# Altium project SCREEN.PrjPCB
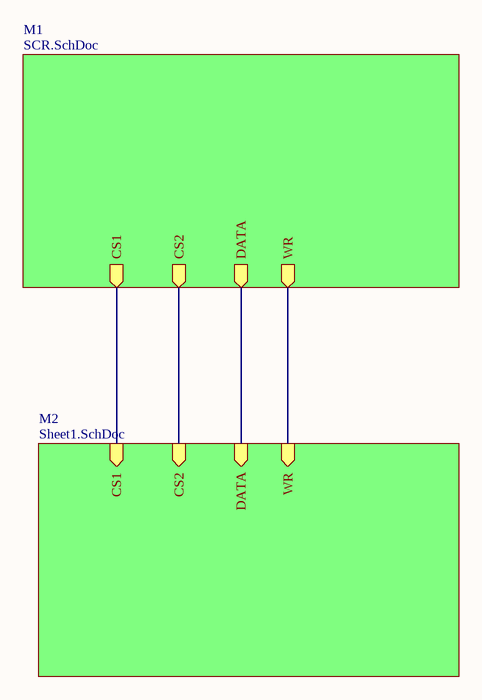
[diagram p0: Sheet4.SchDoc]
3 sheets, 109 parts. Net scope: hierarchical (ports join the sheet entries above them; power ports are global).
Board file: JD1622(V4).PcbDoc
Sheets:
  Sheet4.SchDoc
    M1 = SCR.SchDoc
    M2 = Sheet1.SchDoc

## Sheet Sheet4.SchDoc
size A4

### Sub-sheets
M1 = SCR.SchDoc: CS1 (out), CS2 (out), DATA (out), WR (out)
M2 = Sheet1.SchDoc: CS1 (in), CS2 (in), DATA (in), WR (in)

### Nets
NetR30_1: sheet M1/CS2, sheet M2/CS2
NetR32_1: sheet M1/WR, sheet M2/WR
NetR35_1: sheet M1/DATA, sheet M2/DATA
NetR37_1: sheet M1/CS1, sheet M2/CS1

## Sheet SCR.SchDoc
size A2
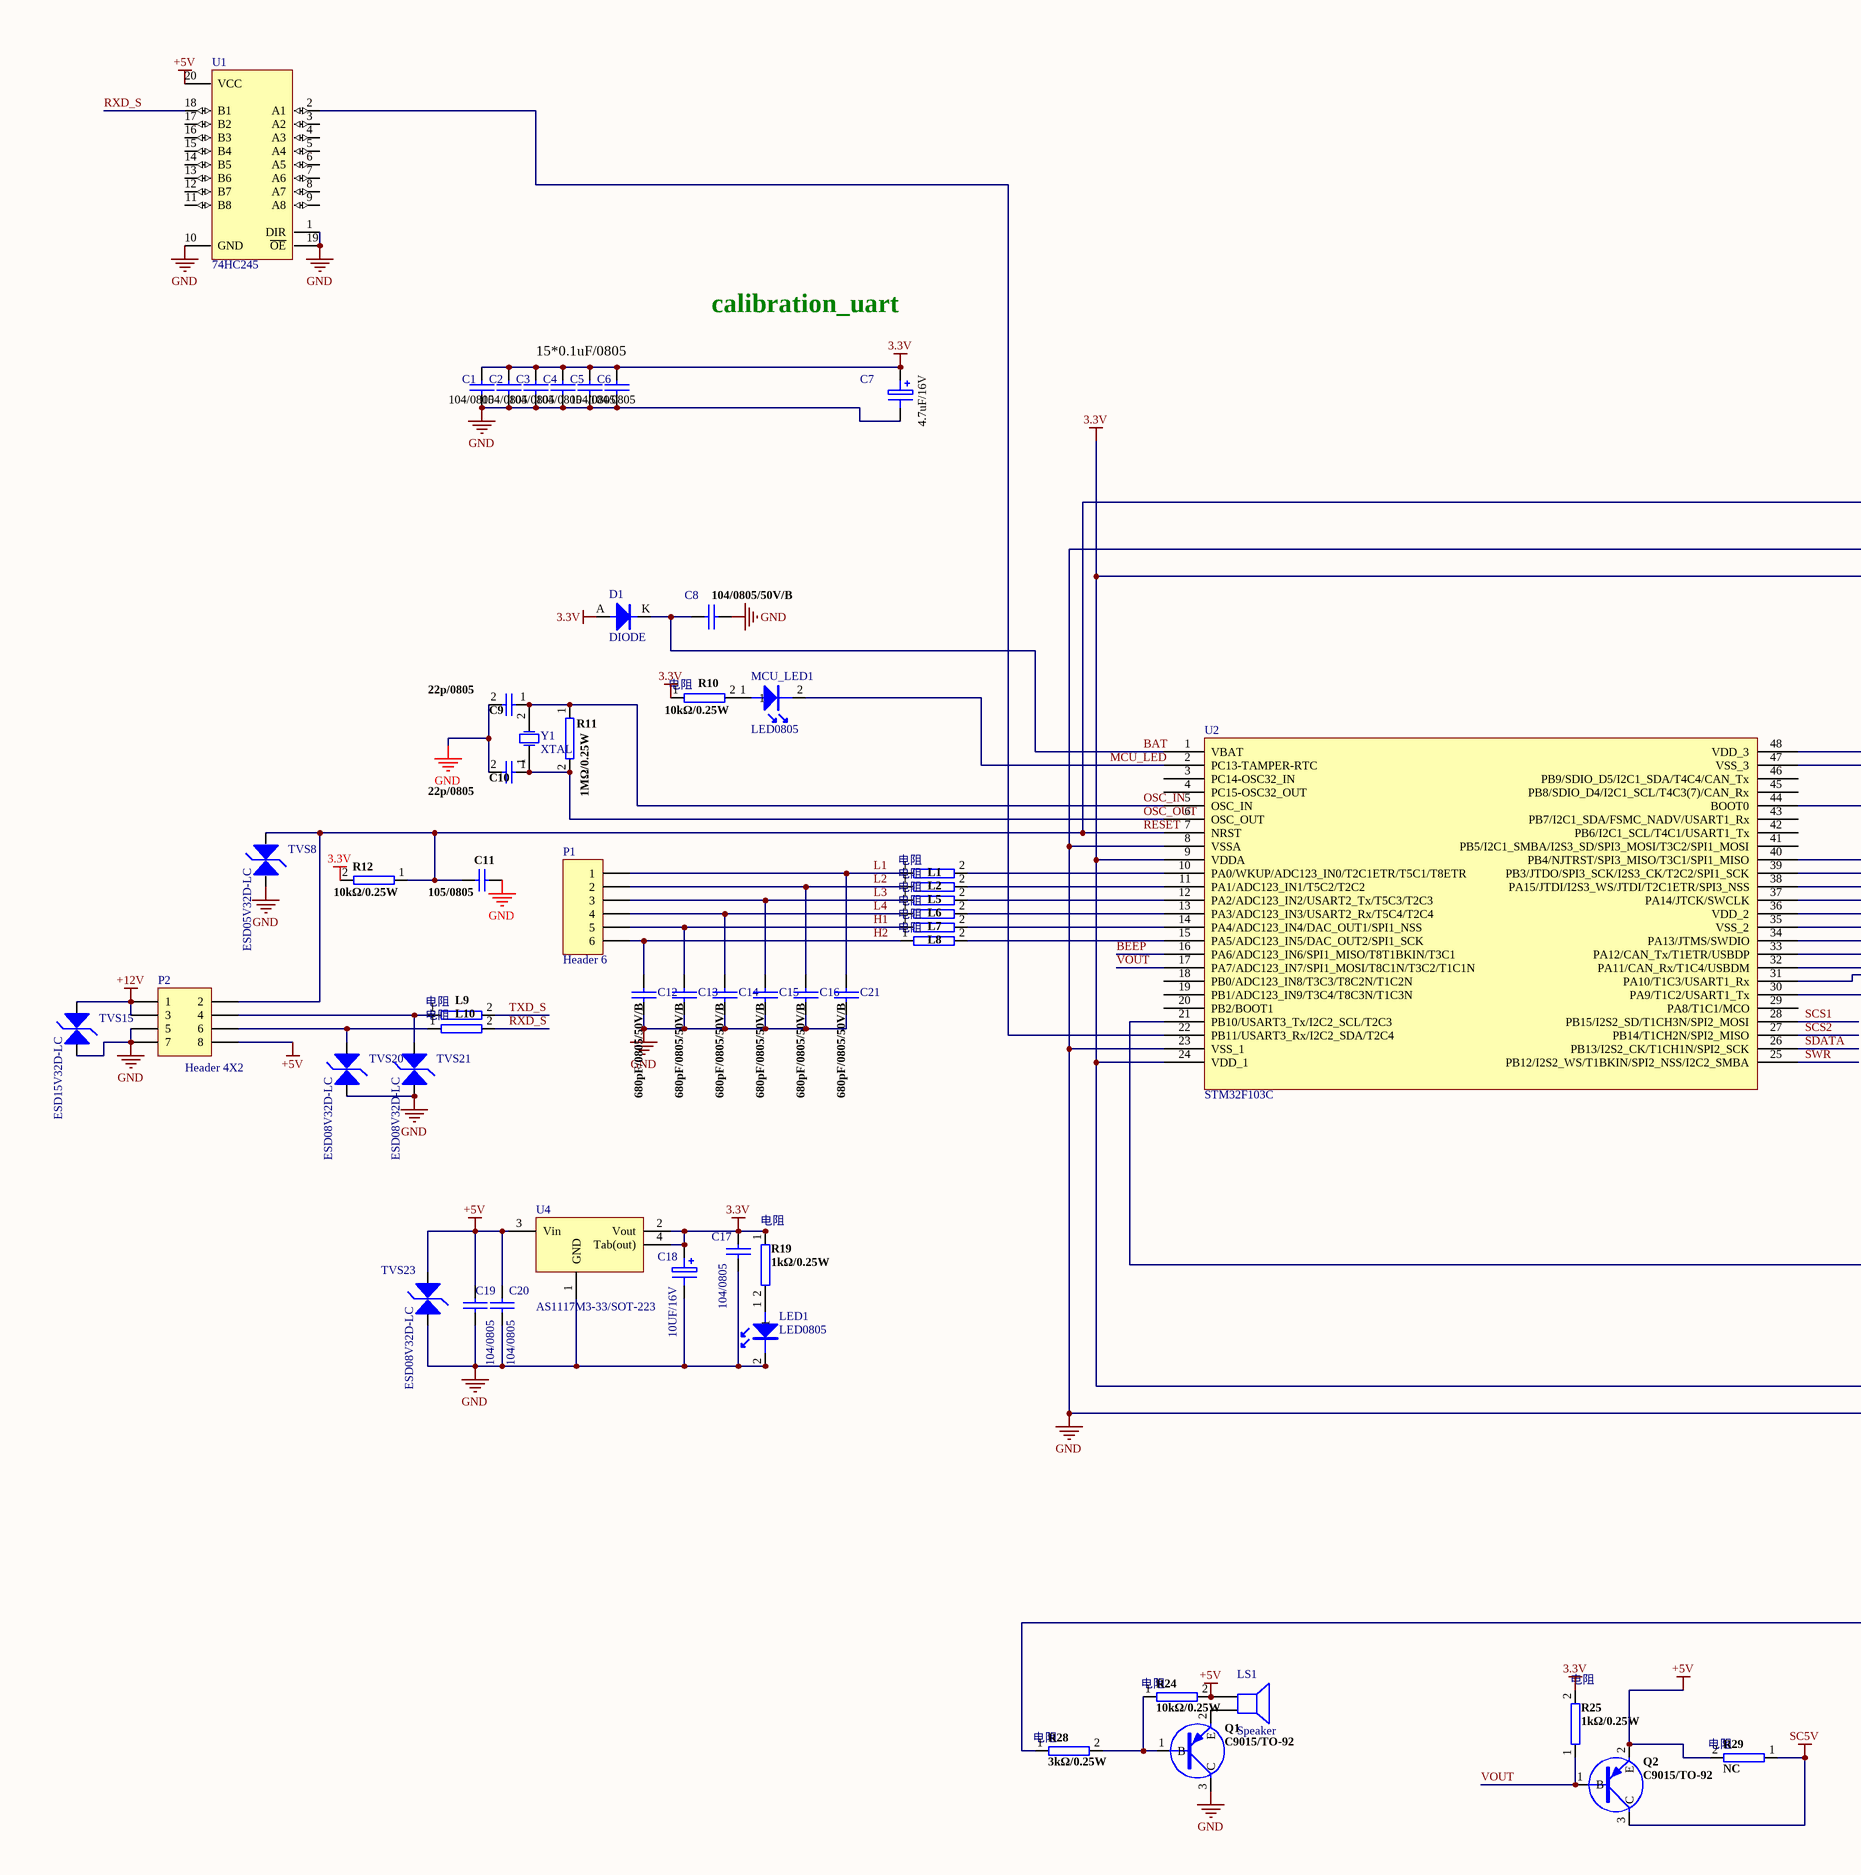
[diagram p1: SCR.SchDoc, left]
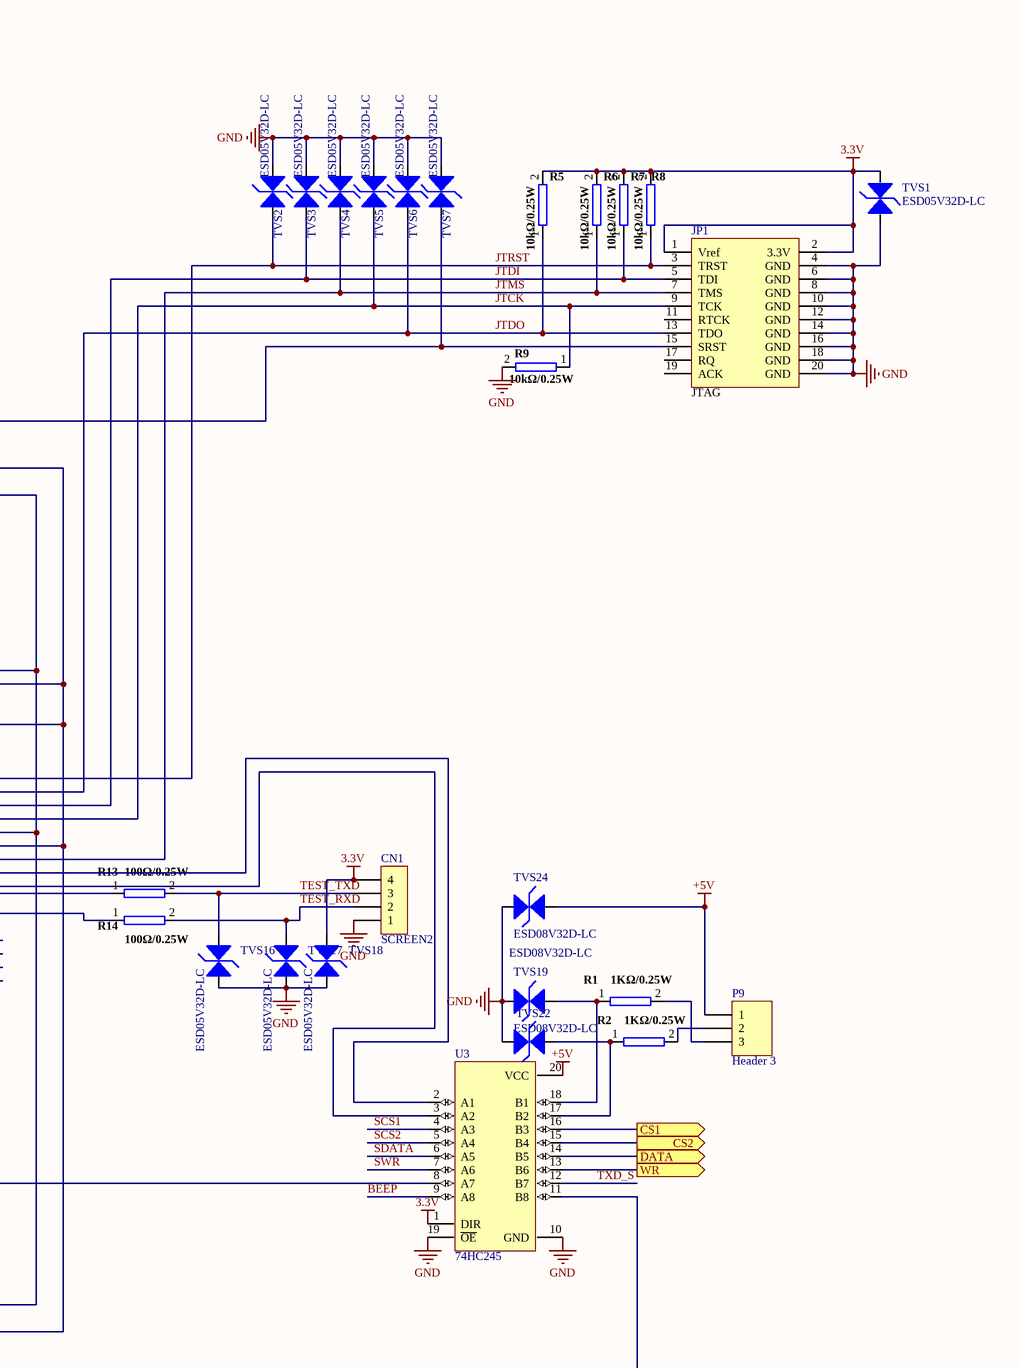
[diagram p2: SCR.SchDoc, right]

### Parts
C1  104/0805  [C0805]
C2  104/0805  [C0805]
C3  104/0805  [C0805]
C4  104/0805  [C0805]
C5  104/0805  [C0805]
C6  104/0805  [C0805]
C7  4.7uF/16V  [CAP5X5]
C8  value 104/0805/50V/B  [C0805]  (hidden comment: 104/0805)
C9  22p/0805  [C0805]
C10  22p/0805  [C0805]
C11  105/0805  [C0805]
C12  value 680pF/0805/50V/B  [C0805]  (hidden comment: 104/0805)
C13  value 680pF/0805/50V/B  [C0805]  (hidden comment: 104/0805)
C14  value 680pF/0805/50V/B  [C0805]  (hidden comment: 104/0805)
C15  value 680pF/0805/50V/B  [C0805]  (hidden comment: 104/0805)
C16  value 680pF/0805/50V/B  [C0805]  (hidden comment: 104/0805)
C17  104/0805  [C0805]
C18  10UF/16V  [C3216]
C19  104/0805  [C0805]
C20  104/0805  [C0805]
C21  value 680pF/0805/50V/B  [C0805]  (hidden comment: 104/0805)
CN1  SCREEN2  [4Pin-2.54]
D1  DIODE  [SOD123]
JP1  JTAG  [IDC20_A]
L1  FBMA-11-160808-601T  [R0805]  (value not drawn)
L2  FBMA-11-160808-601T  [R0805]  (value not drawn)
L5  FBMA-11-160808-601T  [R0805]  (value not drawn)
L6  FBMA-11-160808-601T  [R0805]  (value not drawn)
L7  FBMA-11-160808-601T  [R0805]  (value not drawn)
L8  FBMA-11-160808-601T  [R0805]  (value not drawn)
L9  FBMA-11-160808-601T  [R0805]  (value not drawn)
L10  FBMA-11-160808-601T  [R0805]  (value not drawn)
LED1  LED0805  [LED_0805]
LS1  Speaker  [SPK]
MCU_LED1  LED0805  [LED_0805]
P1  Header 6  [HDR1X6]
P2  Header 4X2  [RJ45]
P9  Header 3  [HDR1X3]
Q1  C9015/TO-92  [TO-92B]
Q2  C9015/TO-92  [SOT-23 - 9015]
R1  1KΩ/0.25W  [R0805]
R2  1KΩ/0.25W  [R0805]
R5  10kΩ/0.25W  [R0805]
R6  10kΩ/0.25W  [R0805]
R7  10kΩ/0.25W  [R0805]
R8  10kΩ/0.25W  [R0805]
R9  10kΩ/0.25W  [R0805]
R10  10kΩ/0.25W  [R0805]
R11  1MΩ/0.25W  [R0805]
R12  10kΩ/0.25W  [R0805]
R13  100Ω/0.25W  [R0805]
R14  100Ω/0.25W  [R0805]
R19  1kΩ/0.25W  [R0805]
R24  10kΩ/0.25W  [R0805]
R25  1kΩ/0.25W  [R0805]
R28  3kΩ/0.25W  [R0805]
R29  NC  [R0805]
TVS1  ESD05V32D-LC  [SOD323]
TVS2  ESD05V32D-LC  [SOD323]
TVS3  ESD05V32D-LC  [SOD323]
TVS4  ESD05V32D-LC  [SOD323]
TVS5  ESD05V32D-LC  [SOD323]
TVS6  ESD05V32D-LC  [SOD323]
TVS7  ESD05V32D-LC  [SOD323]
TVS8  ESD05V32D-LC  [SOD323]
TVS15  ESD15V32D-LC  [SOD323]
TVS16  ESD05V32D-LC  [SOD323]
TVS17  ESD05V32D-LC  [SOD323]
TVS18  ESD05V32D-LC  [SOD323]
TVS19  ESD08V32D-LC  [SOD323]
TVS20  ESD08V32D-LC  [SOD323]
TVS21  ESD08V32D-LC  [SOD323]
TVS22  ESD08V32D-LC  [SOD323]
TVS23  ESD08V32D-LC  [SOD323]
TVS24  ESD08V32D-LC  [SOD323]
U1  74HC245  [SOP-20]
U2  STM32F103C  [LC-LQFP-48_7x7x05P]
U3  74HC245  [SOP-20]
U4  AS1117M3-33/SOT-223  [SOT-223-3L(M3)]
Y1  XTAL  [XTAL2]

### Ports
CS1 (out), CS2 (out), DATA (out), WR (out)

### Nets
3.3V: C1.1 C2.1 C3.1 C4.1 C5.1 C6.1 C7.1 C17.1 C18.1 CN1.4 D1.A JP1.1(Vref) JP1.2(3.3V) R5.2 R6.2 R7.2 R8.2 R10.1 R12.2 R19.1 R25.2 TVS1.1 TVS18.1 U2.9(VDDA) U2.24(VDD_1) U2.36(VDD_2) U2.48(VDD_3) U3.1(DIR) U4.2(Vout) U4.4(Tab(out))
+5V: C19.1 C20.1 LS1.1 P2.8 P9.1 Q2.2(E) R24.2 R29.2 TVS23.1 TVS24.1 U1.20(VCC) U3.20(VCC) U4.3(Vin)
+12V: P2.1 P2.3 TVS15.1
GND: C1.2 C2.2 C3.2 C4.2 C5.2 C6.2 C7.2 C8.2 C9.2 C10.2 C11.1 C12.1 C13.1 C14.1 C15.1 C16.1 C17.2 C18.2 C19.2 C20.2 C21.1 CN1.1 JP1.4(GND) JP1.6(GND) JP1.8(GND) JP1.10(GND) JP1.12(GND) JP1.14(GND) JP1.16(GND) JP1.18(GND) JP1.20(GND) LED1.2 P2.5 P2.7 Q1.3(C) R9.2 TVS1.2 TVS2.2 TVS3.2 TVS4.2 TVS5.2 TVS6.2 TVS7.2 TVS8.2 TVS15.2 TVS16.2 TVS17.2 TVS18.2 TVS19.2 TVS20.2 TVS21.2 TVS22.1 TVS23.2 TVS24.2 U1.1(DIR) U1.10(GND) U1.19(~{OE}) U2.8(VSSA) U2.23(VSS_1) U2.35(VSS_2) U2.44(BOOT0) U2.47(VSS_3) U3.10(GND) U3.19(~{OE}) U4.1(GND)
SC5V: Q2.3(C) R29.1
BAT: C8.1 D1.K U2.1(VBAT)
BEEP: U2.16(PA6/ADC123_IN6/SPI1_MISO/T8T1BKIN/T3C1) U3.9(A8)
H1: C13.2 L7.1 P1.5
H2: C12.2 L8.1 P1.6
JTCK: JP1.9(TCK) R9.1 TVS5.1 U2.37(PA14/JTCK/SWCLK)
JTDI: JP1.5(TDI) R7.1 TVS3.1 U2.38(PA15/JTDI/I2S3_WS/JTDI/T2C1ETR/SPI3_NSS)
JTDO: JP1.13(TDO) R5.1 TVS6.1 U2.39(PB3/JTDO/SPI3_SCK/I2S3_CK/T2C2/SPI1_SCK)
JTMS: JP1.7(TMS) R6.1 TVS4.1 U2.34(PA13/JTMS/SWDIO)
JTRST: JP1.3(TRST) R8.1 TVS2.1 U2.40(PB4/NJTRST/SPI3_MISO/T3C1/SPI1_MISO)
L1: C21.2 L1.1 P1.1
L2: C16.2 L2.1 P1.2
L3: C15.2 L5.1 P1.3
L4: C14.2 L6.1 P1.4
MCU_LED: MCU_LED1.2 U2.2(PC13-TAMPER-RTC)
OSC_IN: C9.1 R11.1 U2.5(OSC_IN) Y1.2(OSC2)
OSC_OUT: C10.1 R11.2 U2.6(OSC_OUT) Y1.1(OSC1)
RESET: C11.2 JP1.15(SRST) P2.2 R12.1 TVS7.1 TVS8.1 U2.7(NRST)
RXD_S: L10.2 U1.18(B1)
SCS1: U2.28(PB15/I2S2_SD/T1CH3N/SPI2_MOSI) U3.4(A3)
SCS2: U2.27(PB14/T1CH2N/SPI2_MISO) U3.5(A4)
SDATA: U2.26(PB13/I2S2_CK/T1CH1N/SPI2_SCK) U3.6(A5)
SWR: U2.25(PB12/I2S2_WS/T1BKIN/SPI2_NSS/I2C2_SMBA) U3.7(A6)
TEST_RXD: CN1.2 R14.2 TVS17.1
TEST_TXD: CN1.3 R13.2 TVS16.1
TXD_S: L9.2 U3.12(B7)
VOUT: Q2.1(B) R25.1 U2.17(PA7/ADC123_IN7/SPI1_MOSI/T8C1N/T3C2/T1C1N)
NetL1_2: L1.2 U2.10(PA0/WKUP/ADC123_IN0/T2C1ETR/T5C1/T8ETR)
NetL2_2: L2.2 U2.11(PA1/ADC123_IN1/T5C2/T2C2)
NetL5_2: L5.2 U2.12(PA2/ADC123_IN2/USART2_Tx/T5C3/T2C3)
NetL6_2: L6.2 U2.13(PA3/ADC123_IN3/USART2_Rx/T5C4/T2C4)
NetL7_2: L7.2 U2.14(PA4/ADC123_IN4/DAC_OUT1/SPI1_NSS)
NetL8_2: L8.2 U2.15(PA5/ADC123_IN5/DAC_OUT2/SPI1_SCK)
NetL9_1: L9.1 P2.4 TVS21.1
NetL10_1: L10.1 P2.6 TVS20.1
NetLED1_1: LED1.1 R19.2
NetLS1_2: LS1.2 Q1.2(E)
NetMCU_LED1_1: MCU_LED1.1 R10.2
NetP9_2: P9.2 R2.2
NetP9_3: P9.3 R1.2
NetQ1_1: Q1.1(B) R24.1 R28.2
NetR1_1: R1.1 TVS19.1 U3.18(B1)
NetR2_1: R2.1 TVS22.2 U3.17(B2)
NetR13_1: R13.1 U2.31(PA10/T1C3/USART1_Rx)
NetR14_1: R14.1 U2.30(PA9/T1C2/USART1_Tx)
NetR28_1: R28.1 U3.11(B8)
NetR30_1: U3.15(B4) ; port CS2
NetR32_1: U3.13(B6) ; port WR
NetR35_1: U3.14(B5) ; port DATA
NetR37_1: U3.16(B3) ; port CS1
NetU1_2: U1.2(A1) U2.22(PB11/USART3_Rx/I2C2_SDA/T2C4)
NetU2_21: U2.21(PB10/USART3_Tx/I2C2_SCL/T2C3) U3.8(A7)
NetU2_32: U2.32(PA11/CAN_Rx/T1C4/USBDM) U3.3(A2)
NetU2_33: U2.33(PA12/CAN_Tx/T1ETR/USBDP) U3.2(A1)

Not connected (* = marked no-connect by the designer): JP1 11(RTCK) 17(RQ) 19(ACK); U1 3(A2) 4(A3) 5(A4) 6(A5) 7(A6) 8(A7) 9(A8) 11(B8) 12(B7) 13(B6) 14(B5) 15(B4) 16(B3) 17(B2); U2 3(PC14-OSC32_IN) 4(PC15-OSC32_OUT) 18(PB0/ADC123_IN8/T3C3/T8C2N/T1C2N) 19(PB1/ADC123_IN9/T3C4/T8C3N/T1C3N) 20(PB2/BOOT1) 29(PA8/T1C1/MCO) 41(PB5/I2C1_SMBA/I2S3_SD/SPI3_MOSI/T3C2/SPI1_MOSI) 42(PB6/I2C1_SCL/T4C1/USART1_Tx) 43(PB7/I2C1_SDA/FSMC_NADV/USART1_Rx) 45(PB8/SDIO_D4/I2C1_SCL/T4C3(7)/CAN_Rx) 46(PB9/SDIO_D5/I2C1_SDA/T4C4/CAN_Tx)

### Notes on the sheet
- calibration_uart
- 15*0.1uF/0805
- (in symbol RES2) 电阻

### Library data of the parts
C1-C6 C8 C12-C17 C19-C21 = CAP: Capacitor
  C19 C20: value: *
C7 C18 = ELECTRO1: Electrolytic Capacitor
C9 C10 = CAP
C11 = CAP: Capacitor; Value: 100pF; Published: 8-Jun-2000; Revision: July-2002: Re-released for DXP Platform.; Publisher: Altium Limited
CN1 = CON4: Connector
JP1 = JTAG20
L1 L2 L5-L10 R10 R19 R24 R25 R28 R29 = RES2: Part Field 1: 06-115611-18
LS1 = Speaker: Loudspeaker; Published: 24-Mar-1999; LatestRevisionDate: 17-Jul-2002; LatestRevisionNote: Re-released for DXP Platform.; PackageReference: PIN2; Publisher: Altium Limited
P1 = Header 6: Header, 6-Pin; LatestRevisionDate: 17-Jul-2002; LatestRevisionNote: Re-released for DXP Platform.; Publisher: Altium Limited
P2 = Header 4X2: Header, 4-Pin, Dual row; LatestRevisionDate: 17-Jul-2002; LatestRevisionNote: Re-released for DXP Platform.; Publisher: Altium Limited
P9 = Header 3: Header, 3-Pin; LatestRevisionDate: 17-Jul-2002; LatestRevisionNote: Re-released for DXP Platform.; Publisher: Altium Limited
Q1 Q2 = PNP
R1 R2 R5-R9 R11-R14 = RES2
TVS1-TVS8 TVS15-TVS24 = TVS
U1 U3 = 74LS245
U2 = ST: STM32单片机48引脚
U4 = AS1117M3-33: 物?: *; 部?: *; 供?: *
Y1 = XTAL: Crystal Oscillator; Published: 8-Jun-2000; LatestRevisionDate: 17-Jul-2002; LatestRevisionNote: Re-released for DXP Platform.; PackageReference: R38; Publisher: Altium Limited; PackageDescription: Crystal, Thru-Hole; 2 Leads; Body 3.1 x 8.2 mm (Dia.xH)

## Sheet Sheet1.SchDoc
size A3
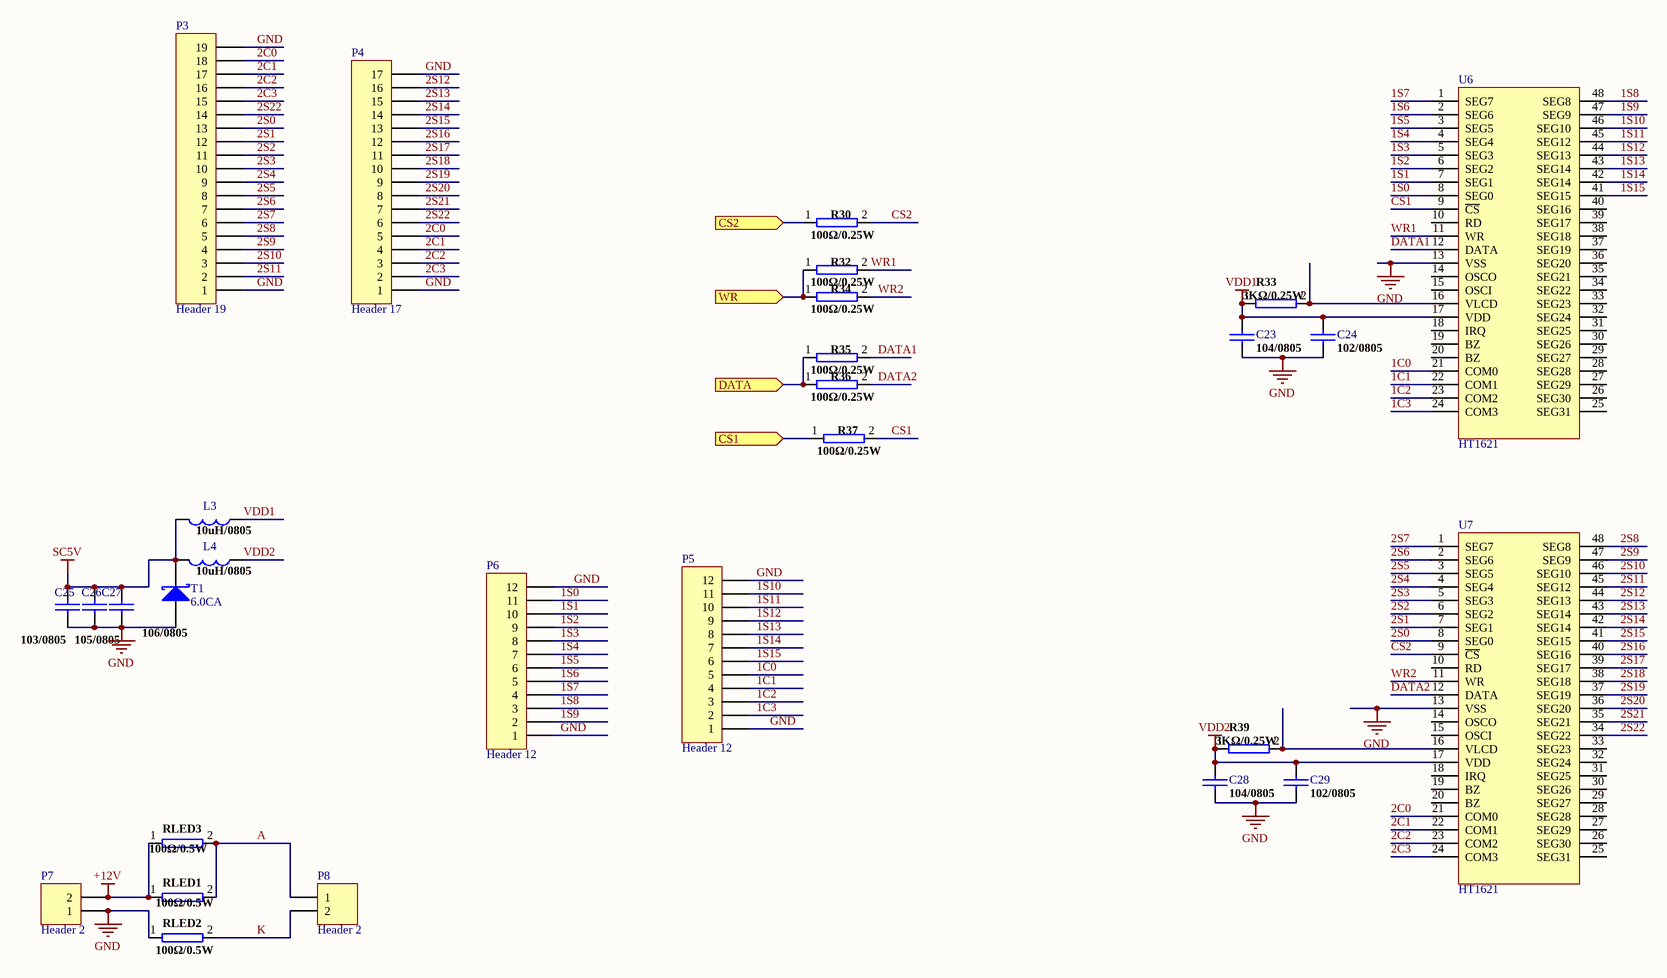
[diagram p3: Sheet1.SchDoc]

### Parts
C23  104/0805  [C0805]
C24  102/0805  [C0805]
C25  103/0805  [C0805]
C26  105/0805  [C0805]
C27  106/0805  [C0805]
C28  104/0805  [C0805]
C29  102/0805  [C0805]
L3  10uH/0805  [L0805]
L4  10uH/0805  [L0805]
P3  Header 19  [H1*19]
P4  Header 17  [H1*17]
P5  Header 12  [H1*12]
P6  Header 12  [H1*12]
P7  Header 2  [CN2]
P8  Header 2  [CN2]
R30  100Ω/0.25W  [R0805]
R32  100Ω/0.25W  [R0805]
R33  3KΩ/0.25W  [R0805]
R34  100Ω/0.25W  [R0805]
R35  100Ω/0.25W  [R0805]
R36  100Ω/0.25W  [R0805]
R37  100Ω/0.25W  [R0805]
R39  3KΩ/0.25W  [R0805]
RLED1  100Ω/0.5W  [1206]
RLED2  100Ω/0.5W  [1206]
RLED3  100Ω/0.5W  [1206]
T1  6.0CA  [TVS]
U6  HT1621  [HT1621B(SSOP)]
U7  HT1621  [HT1621B(SSOP)]

### Ports
CS1 (in), CS2 (in), DATA (in), WR (in)

### Nets
+12V: P7.2 RLED1.1 RLED3.1
GND: C23.2 C24.2 C25.2 C26.2 C27.2 C28.2 C29.2 P3.1 P3.19 P4.1 P4.17 P5.1 P5.12 P6.1 P6.12 P7.1 RLED2.1 T1.1(A) U6.13(VSS) U7.13(VSS)
SC5V: C25.1 C26.1 C27.1 L3.1 L4.1 T1.2(K)
VDD1: C23.1 C24.1 L3.2 R33.1 U6.17(VDD)
VDD2: C28.1 C29.1 L4.2 R39.1 U7.17(VDD)
1C0: P5.5 U6.21(COM0)
1C1: P5.4 U6.22(COM1)
1C2: P5.3 U6.23(COM2)
1C3: P5.2 U6.24(COM3)
1S0: P6.11 U6.8(SEG0)
1S1: P6.10 U6.7(SEG1)
1S2: P6.9 U6.6(SEG2)
1S3: P6.8 U6.5(SEG3)
1S4: P6.7 U6.4(SEG4)
1S5: P6.6 U6.3(SEG5)
1S6: P6.5 U6.2(SEG6)
1S7: P6.4 U6.1(SEG7)
1S8: P6.3 U6.48(SEG8)
1S9: P6.2 U6.47(SEG9)
1S10: P5.11 U6.46(SEG10)
1S11: P5.10 U6.45(SEG12)
1S12: P5.9 U6.44(SEG13)
1S13: P5.8 U6.43(SEG14)
1S14: P5.7 U6.42(SEG14)
1S15: P5.6 U6.41(SEG15)
2C0: P3.18 P4.5 U7.21(COM0)
2C1: P3.17 P4.4 U7.22(COM1)
2C2: P3.16 P4.3 U7.23(COM2)
2C3: P3.15 P4.2 U7.24(COM3)
2S0: P3.13 U7.8(SEG0)
2S1: P3.12 U7.7(SEG1)
2S2: P3.11 U7.6(SEG2)
2S3: P3.10 U7.5(SEG3)
2S4: P3.9 U7.4(SEG4)
2S5: P3.8 U7.3(SEG5)
2S6: P3.7 U7.2(SEG6)
2S7: P3.6 U7.1(SEG7)
2S8: P3.5 U7.48(SEG8)
2S9: P3.4 U7.47(SEG9)
2S10: P3.3 U7.46(SEG10)
2S11: P3.2 U7.45(SEG12)
2S12: P4.16 U7.44(SEG13)
2S13: P4.15 U7.43(SEG14)
2S14: P4.14 U7.42(SEG14)
2S15: P4.13 U7.41(SEG15)
2S16: P4.12 U7.40(SEG16)
2S17: P4.11 U7.39(SEG17)
2S18: P4.10 U7.38(SEG18)
2S19: P4.9 U7.37(SEG19)
2S20: P4.8 U7.36(SEG20)
2S21: P4.7 U7.35(SEG21)
2S22: P3.14 P4.6 U7.34(SEG22)
A: P8.1 RLED1.2 RLED3.2
CS1: R37.2 U6.9(~{CS})
CS2: R30.2 U7.9(~{CS})
DATA1: R35.2 U6.12(DATA)
DATA2: R36.2 U7.12(DATA)
K: P8.2 RLED2.2
WR1: R32.2 U6.11(WR)
WR2: R34.2 U7.11(WR)
NetR30_1: R30.1 ; port CS2
NetR32_1: R32.1 R34.1 ; port WR
NetR33_2: R33.2 U6.16(VLCD)
NetR35_1: R35.1 R36.1 ; port DATA
NetR37_1: R37.1 ; port CS1
NetR39_2: R39.2 U7.16(VLCD)

Not connected (* = marked no-connect by the designer): U6 10(RD) 14(OSCO) 15(OSCI) 18(IRQ) 19(BZ) 20(BZ) 25(SEG31) 26(SEG30) 27(SEG29) 28(SEG28) 29(SEG27) 30(SEG26) 31(SEG25) 32(SEG24) 33(SEG23) 34(SEG22) 35(SEG21) 36(SEG20) 37(SEG19) 38(SEG18) 39(SEG17) 40(SEG16); U7 10(RD) 14(OSCO) 15(OSCI) 18(IRQ) 19(BZ) 20(BZ) 25(SEG31) 26(SEG30) 27(SEG29) 28(SEG28) 29(SEG27) 30(SEG26) 31(SEG25) 32(SEG24) 33(SEG23)

### Library data of the parts
C23-C29 = CAP: Capacitor
L3 L4 = INDUCTOR1
P3 = Header 19: Header, 19-Pin; LatestRevisionDate: 17-Jul-2002; LatestRevisionNote: Re-released for DXP Platform.; Publisher: Altium Limited
P4 = Header 17: Header, 17-Pin; LatestRevisionDate: 17-Jul-2002; LatestRevisionNote: Re-released for DXP Platform.; Publisher: Altium Limited
P5 P6 = Header 12: Header, 12-Pin; LatestRevisionDate: 17-Jul-2002; LatestRevisionNote: Re-released for DXP Platform.; Publisher: Altium Limited
P7 P8 = Header 2: Header, 2-Pin; LatestRevisionDate: 17-Jul-2002; LatestRevisionNote: Re-released for DXP Platform.; Publisher: Altium Limited
R30 R32-R37 R39 RLED1-RLED3 = RES2
T1 = Diode 11DQ03: Schottky Rectifier; Published: 8-Jun-2000; LatestRevisionDate: 17-Jul-2002; LatestRevisionNote: Re-released for DXP Platform.; DatasheetVersion: Dec-1997; PackageReference: DO-204AL; Publisher: Altium Limited; PackageDescription: Diode, Axial; Body 5.2 x 2.7 mm (LxDia. max), Lead Dia. 0.86 mm (max); Code_JEDEC: DO-204-AL; ComponentLink1Description: Manufacturer Link; ComponentLink1URL: http://www.irf.com/; ComponentLink2Description: Datasheet; ComponentLink2URL: http://www.irf.com/product-info/datasheets/data/11dq03.pdf

## Nets that join several sheets
+12V: SCR (P2.1 P2.3 TVS15.1), Sheet1 (P7.2 RLED1.1 RLED3.1)
GND: SCR (65 pins), Sheet1 (20 pins)
SC5V: SCR (Q2.3 R29.1), Sheet1 (6 pins)
NetR30_1: SCR (U3.15), Sheet1 (R30.1)
NetR32_1: SCR (U3.13), Sheet1 (R32.1 R34.1)
NetR35_1: SCR (U3.14), Sheet1 (R35.1 R36.1)
NetR37_1: SCR (U3.16), Sheet1 (R37.1)